# EAGLE design 709_universal_i2c (EAGLE 7.6.0)
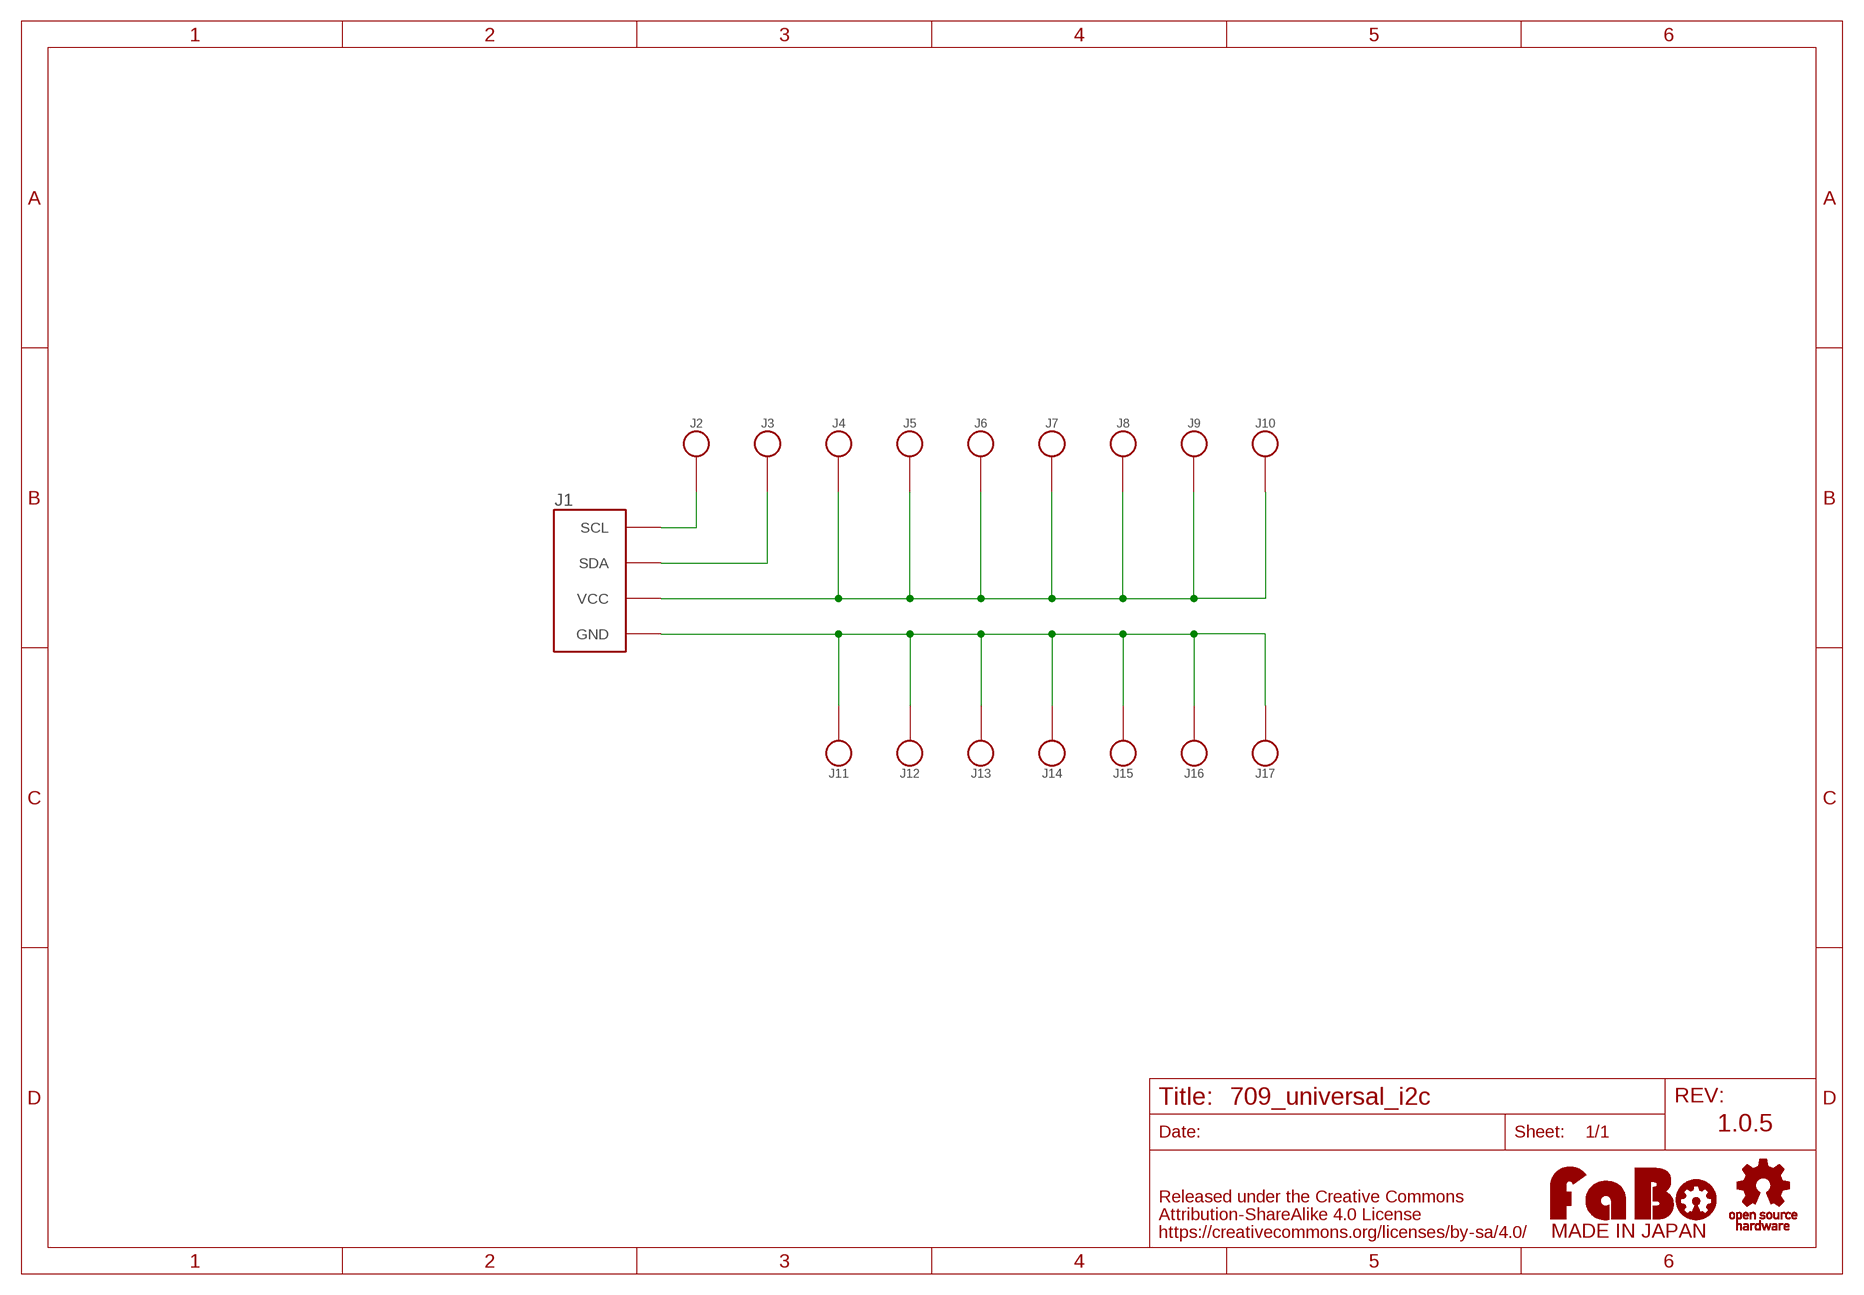
[diagram p0: schematic, sheet 1]

## Parts
J1  FABO_BRICK_I2C-UNIVERSAL  [FABO_BRICK_I2C_UNIVERSAL]
J2  PIN_HEADER_1X1_NOLABEL  [PIN_1X1_NOLABEL]
J3  PIN_HEADER_1X1_NOLABEL  [PIN_1X1_NOLABEL]
J4  PIN_HEADER_1X1_NOLABEL  [PIN_1X1_NOLABEL]
J5  PIN_HEADER_1X1_NOLABEL  [PIN_1X1_NOLABEL]
J6  PIN_HEADER_1X1_NOLABEL  [PIN_1X1_NOLABEL]
J7  PIN_HEADER_1X1_NOLABEL  [PIN_1X1_NOLABEL]
J8  PIN_HEADER_1X1_NOLABEL  [PIN_1X1_NOLABEL]
J9  PIN_HEADER_1X1_NOLABEL  [PIN_1X1_NOLABEL]
J10  PIN_HEADER_1X1_NOLABEL  [PIN_1X1_NOLABEL]
J11  PIN_HEADER_1X1_NOLABEL  [PIN_1X1_NOLABEL]
J12  PIN_HEADER_1X1_NOLABEL  [PIN_1X1_NOLABEL]
J13  PIN_HEADER_1X1_NOLABEL  [PIN_1X1_NOLABEL]
J14  PIN_HEADER_1X1_NOLABEL  [PIN_1X1_NOLABEL]
J15  PIN_HEADER_1X1_NOLABEL  [PIN_1X1_NOLABEL]
J16  PIN_HEADER_1X1_NOLABEL  [PIN_1X1_NOLABEL]
J17  PIN_HEADER_1X1_NOLABEL  [PIN_1X1_NOLABEL]
U$2  LOGO_OSHW-M_BOTTOM  [LOGO_OSHW_M_BOTTOM]
U$17  LOGO_FABO-M_BOTTOM  [LOGO_FABO_MS_BOTTOM]

## Nets
GND: J1.GND J11.1 J12.1 J13.1 J14.1 J15.1 J16.1 J17.1
SCL: J1.SCL J2.1
SDA: J1.SDA J3.1
VCC: J1.VCC J4.1 J5.1 J6.1 J7.1 J8.1 J9.1 J10.1

## Notes on the sheet
- 1.0.5

## Library data of the parts
J1 = FaBo-Template:FABO_BRICK_I2C: FaBo Brick I2C
J2-J17 = FaBo-PIN:PIN_HEADER_1X1_NOLABEL
U$2 = FaBo-etc:LOGO_OSHW
U$17 = FaBo-etc:LOGO_FABO

## Board
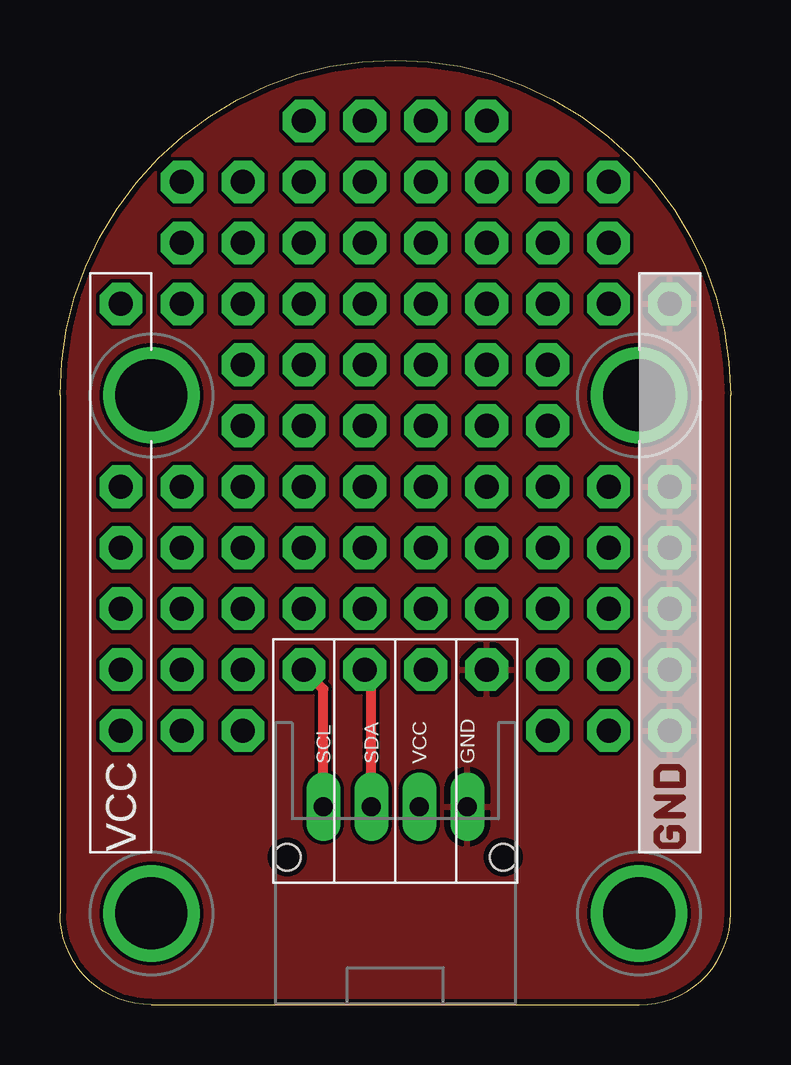
[diagram p1: board, top side]
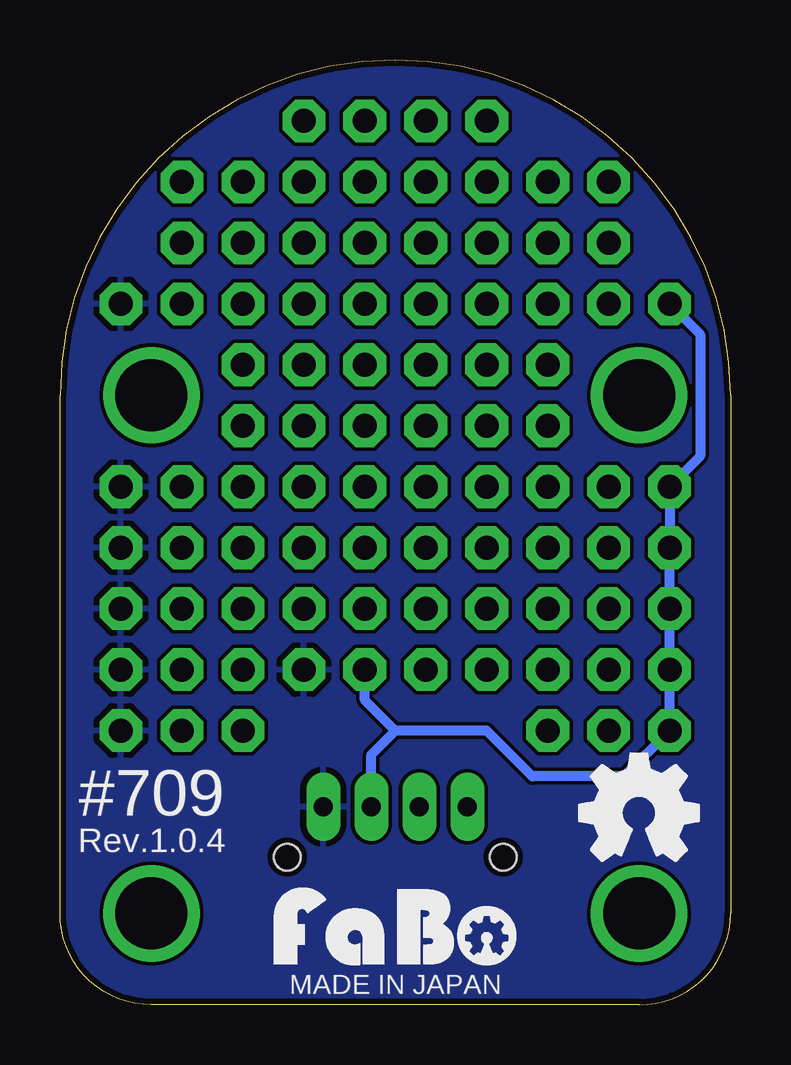
[diagram p2: board, bottom side, seen from below]

Size 27.94 x 39.37 mm. Coordinates in mm from the lower left corner, seen from the top.
Copper layers (1*16): Top 0.035mm / dielectric 1.5mm / Bottom 0.035mm
Design rules "SeeedStudio_2layer_DRU_no_angle_20140221": minimum track width 6mil, minimum drill 12mil, track to track 6mil, track to pad 6mil, pad to pad 6mil, via to via 6mil, smd to smd 0mil, copper to edge 10mil, drill to drill 10mil, minimum pad ring 10mil, minimum via ring 6mil, stop-mask expansion 2mil, vias tented up to drill 100mil, thermal gap 10mil

### Footprints (pad centres in the part's own frame; a part is rotated, then mirrored left to right if it is on the bottom)
FABO_BRICK_I2C_UNIVERSAL = drill 0.8 pad 1.422 long: GND 3,-10.795; SCL -3,-10.795; SDA -1,-10.795; VCC 1,-10.795 | drill 3 pad 3.81: P$1 -10.16,6.35; P$2 10.16,6.35; P$3 -10.16,-15.24; P$4 10.16,-15.24 | drill 1 pad 1.778 octagon: P$5 -6.35,-7.62; P$6 -8.89,-7.62; P$7 6.35,-7.62; P$8 8.89,-7.62; P$9 6.35,-5.08; P$10 8.89,-5.08; P$12 -6.35,-5.08; P$13 -8.89,-5.08; P$18 -8.89,2.54; P$19 -8.89,0; P$20 -8.89,-2.54; P$21 -6.35,-2.54; P$22 -6.35,0; P$23 -6.35,2.54; P$24 -3.81,-2.54; P$25 -3.81,0; P$26 -3.81,2.54; P$27 -1.27,-2.54; P$28 -1.27,0; P$29 -1.27,2.54; P$30 1.27,-2.54; P$31 3.81,-2.54; P$32 6.35,-2.54; P$33 8.89,-2.54; P$35 1.27,0; P$36 3.81,0; P$37 6.35,0; P$38 8.89,0; P$40 1.27,2.54; P$41 3.81,2.54; P$42 6.35,2.54; P$43 8.89,2.54; P$45 6.35,5.08; P$46 3.81,5.08; P$47 1.27,5.08; P$48 -1.27,5.08; P$49 -3.81,5.08; P$50 -6.35,5.08; P$51 -6.35,7.62; P$52 -3.81,7.62; P$53 -1.27,7.62; P$54 1.27,7.62; P$55 3.81,7.62; P$56 6.35,7.62; P$57 6.35,10.16; P$58 8.89,10.16; P$60 3.81,10.16; P$61 1.27,10.16; P$62 -1.27,10.16; P$63 -3.81,10.16; P$64 -6.35,10.16; P$65 -8.89,10.16; P$67 -8.89,12.7; P$68 -6.35,12.7; P$69 -3.81,12.7; P$70 -1.27,12.7; P$71 1.27,12.7; P$72 3.81,12.7; P$73 6.35,12.7; P$74 8.89,12.7; P$75 8.89,15.24; P$76 6.35,15.24; P$77 3.81,15.24; P$78 1.27,15.24; P$79 -1.27,15.24; P$80 -3.81,15.24; P$81 -6.35,15.24; P$82 -8.89,15.24; P$83 -3.81,17.78; P$84 -1.27,17.78; P$85 1.27,17.78; P$86 3.81,17.78 | hole 1.1: -4.5,-12.895; 4.5,-12.895
PIN_1X1_NOLABEL = drill 1 pad 1.778 octagon: 1 0,0

### Placement (x,y rotation side)
J1  13.97,19.05 0 top
J2  10.16,13.97 0 top
J3  12.7,13.97 0 top
J4  15.24,13.97 0 top
J5  2.54,11.43 0 top
J6  2.54,13.97 0 top
J7  2.54,16.51 0 top
J8  2.54,19.05 0 top
J9  2.54,21.59 0 top
J10  2.54,29.21 0 top
J11  17.78,13.97 0 top
J12  25.4,11.43 0 top
J13  25.4,13.97 0 top
J14  25.4,16.51 0 top
J15  25.4,19.05 0 top
J16  25.4,21.59 0 top
J17  25.4,29.21 0 top
U$2  3.81,8 0 top
U$3  [LOGO_SILK_GND]  26.67,6.35 90 top
U$17  13.97,1.27 0 top

### Tracks (layer width: path | path; a pad name or v marks a point on that pad's centre or on a via)
GND
  pour Bottom: 0,0 27.94,0 27.94,39.37 0,39.37
  pour Top: 0,0 27.94,0 27.94,39.37 0,39.37
SCL
  Top 0.406: J1.SCL 10.97,13.16 J2.1
SDA
  Top 0.406: J1.SDA 12.97,13.7 J3.1
VCC
  Bottom 0.406: 13.97,11.43 10.16,11.43 8.26,9.53 4.45,9.53 J5.1 J6.1 J7.1 J8.1 J9.1 1.27,22.86 1.27,27.94 J10.1 | 13.97,11.43 15.24,12.7 J4.1 | J1.VCC 14.97,10.43 13.97,11.43

### Text on the board
tPlace: VCC
bPlace: #709 | Rev.1.0.4 | MADE IN JAPAN